# EAGLE design MEFI (EAGLE 9.6.1)
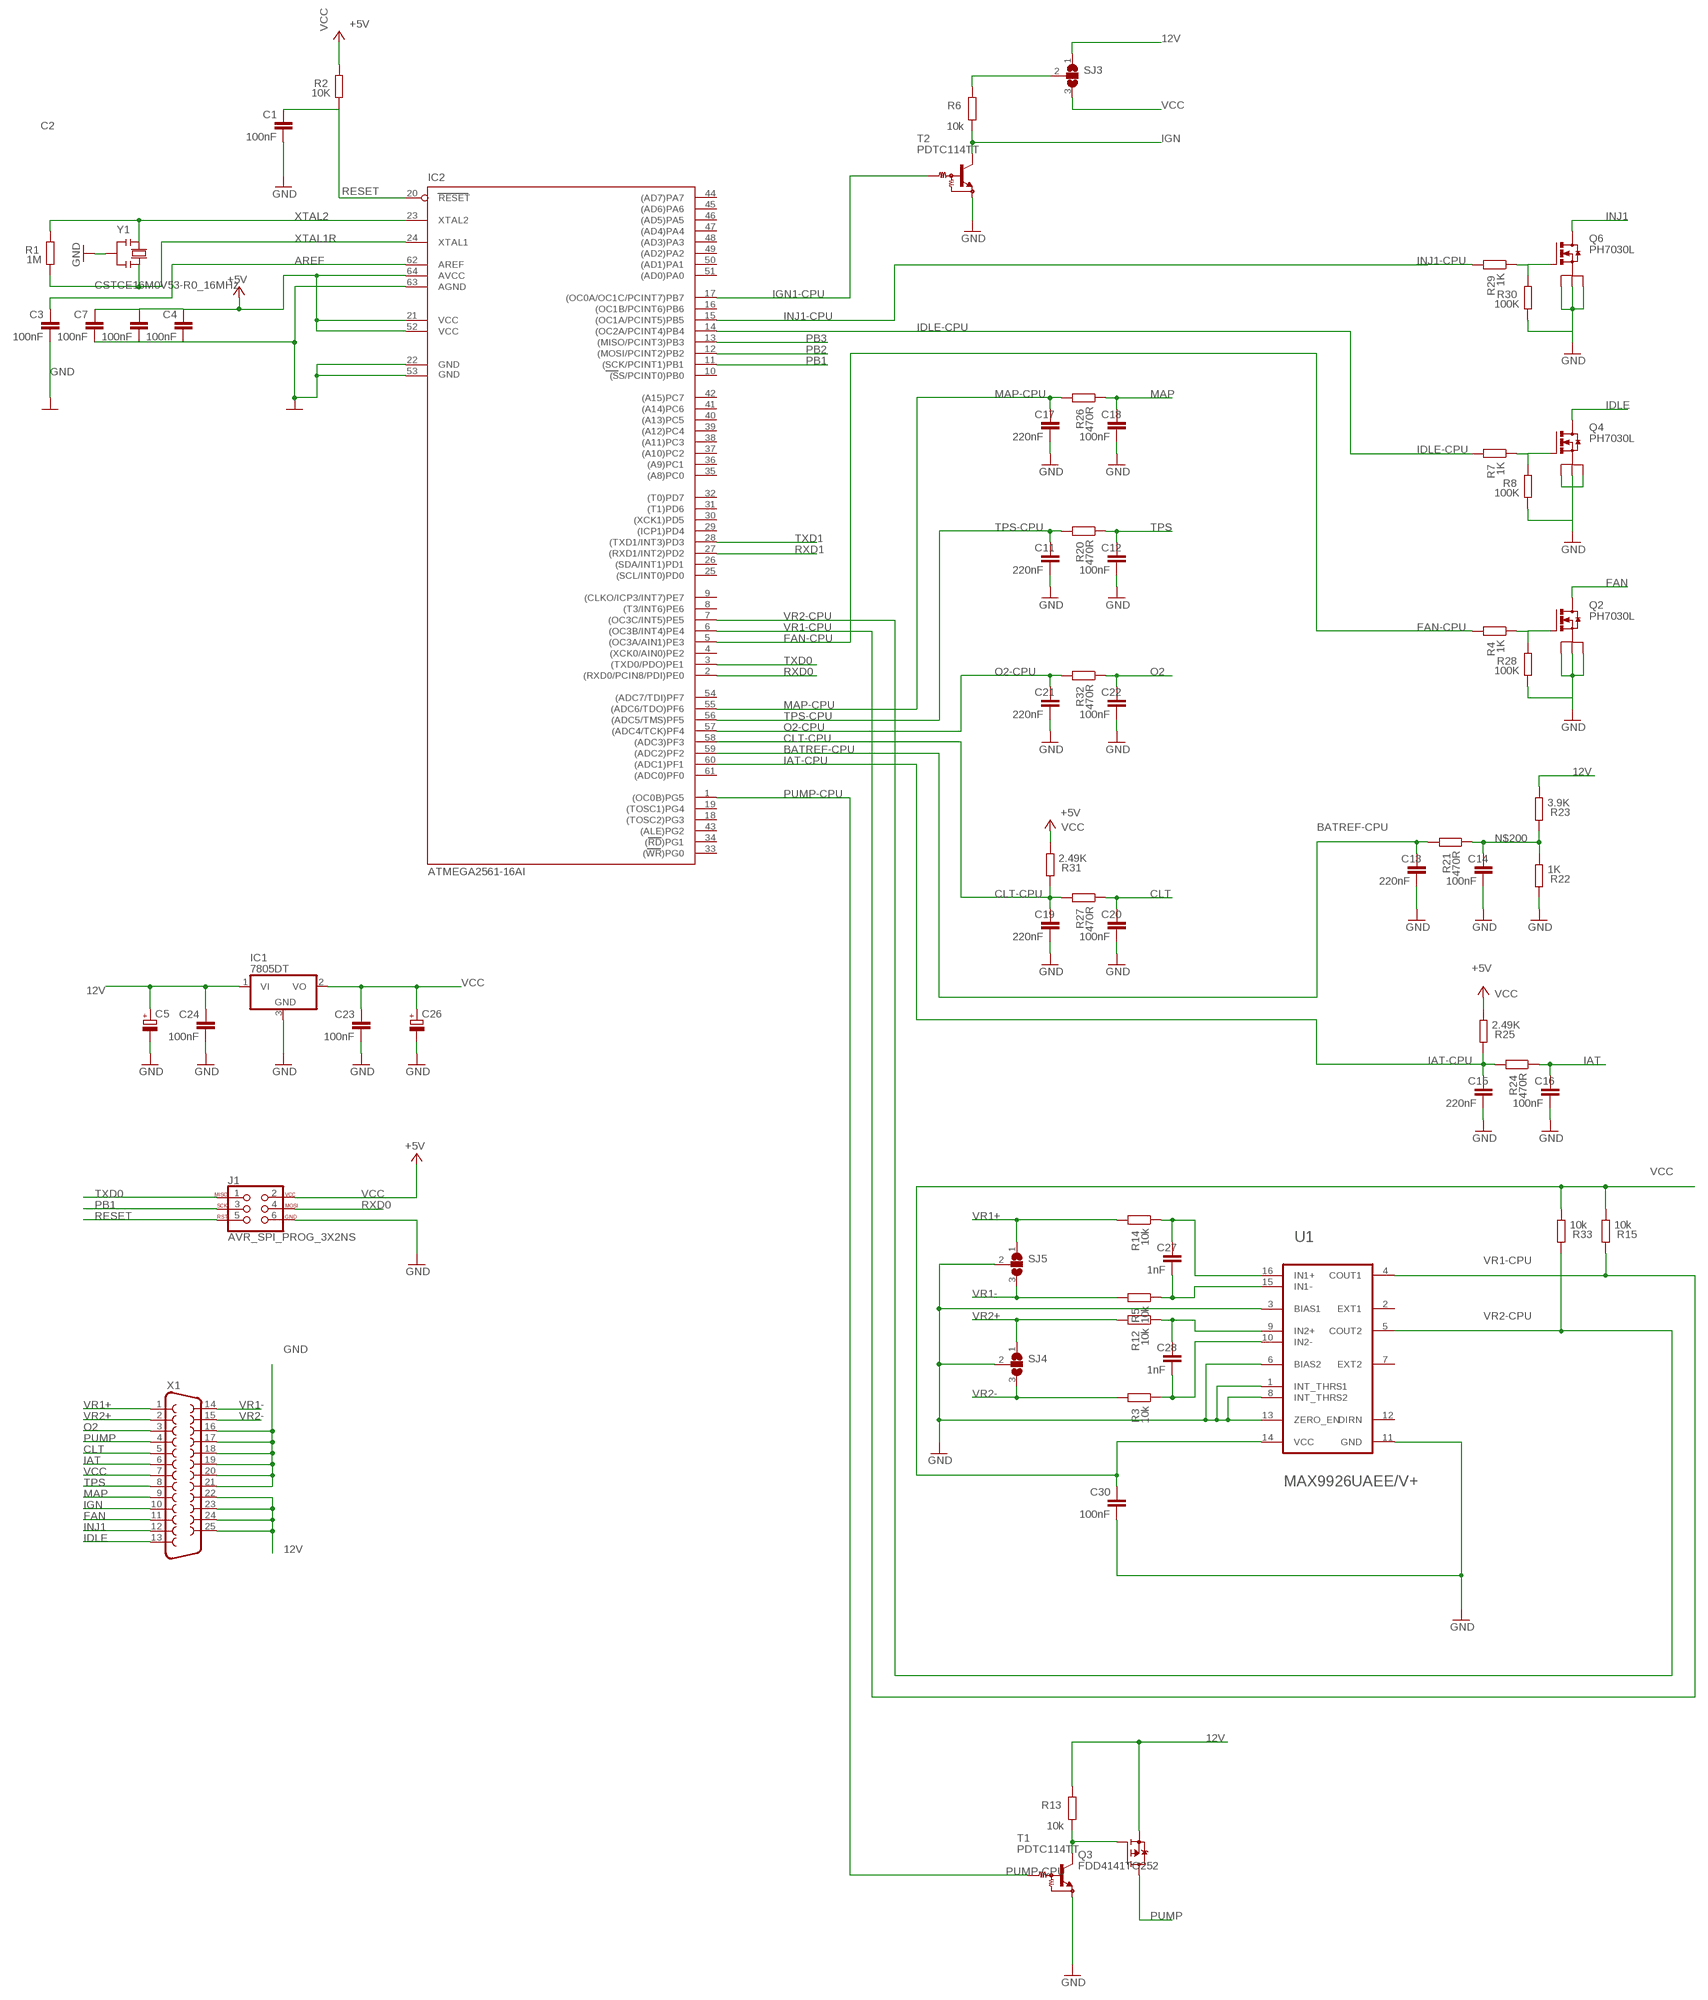
[diagram p0: schematic, sheet 1]

## Parts
C1  100nF  C-EUC0805  [C0805]
C2  100nF  C-EUC0805  [C0805]
C3  100nF  C-EUC0805  [C0805]
C4  100nF  C-EUC0805  [C0805]
C5  CPOL-EUTT2D7L  [TT2D7L]
C7  100nF  C-EUC0805  [C0805]
C11  220nF  C-EUC0805  [C0805]
C12  100nF  C-EUC0805  [C0805]
C13  220nF  C-EUC0805  [C0805]
C14  100nF  C-EUC0805  [C0805]
C15  220nF  C-EUC0805  [C0805]
C16  100nF  C-EUC0805  [C0805]
C17  220nF  C-EUC0805  [C0805]
C18  100nF  C-EUC0805  [C0805]
C19  220nF  C-EUC0805  [C0805]
C20  100nF  C-EUC0805  [C0805]
C21  220nF  C-EUC0805  [C0805]
C22  100nF  C-EUC0805  [C0805]
C23  100nF  C-EUC0805  [C0805]
C24  100nF  C-EUC0805  [C0805]
C26  CPOL-EUTT2D7L  [TT2D7L]
C27  1nF  C-EUC0805  [C0805]
C28  1nF  C-EUC0805  [C0805]
C30  100nF  C-EUC0805  [C0805]
IC1  7805DT  [TO252]
IC2  ATMEGA2561-16AI  [TQFP64]
J1  AVR_SPI_PROG_3X2NS  [2X3-NS]
Q2  PH7030L  [SOT669]
Q3  FDD4141TO252  [TO252]
Q4  PH7030L  [SOT669]
Q6  PH7030L  [SOT669]
R1  1M  R-EU_R0805  [R0805]
R2  10K  R-EU_R0805  [R0805]
R3  10k  R-EU_R0805  [R0805]
R4  1K  R-EU_R0805  [R0805]
R5  10k  R-EU_R0805  [R0805]
R6  10k  R-EU_R0805  [R0805]
R7  1K  R-EU_R0805  [R0805]
R8  100K  R-EU_R0805  [R0805]
R12  10k  R-EU_R0805  [R0805]
R13  10k  R-EU_R0805  [R0805]
R14  10k  R-EU_R0805  [R0805]
R15  10k  R-EU_R0805  [R0805]
R20  470R  R-EU_R0805  [R0805]
R21  470R  R-EU_R0805  [R0805]
R22  1K  R-EU_R0805  [R0805]
R23  3.9K  R-EU_R0805  [R0805]
R24  470R  R-EU_R0805  [R0805]
R25  2.49K  R-EU_R0805  [R0805]
R26  470R  R-EU_R0805  [R0805]
R27  470R  R-EU_R0805  [R0805]
R28  100K  R-EU_R0805  [R0805]
R29  1K  R-EU_R0805  [R0805]
R30  100K  R-EU_R0805  [R0805]
R31  2.49K  R-EU_R0805  [R0805]
R32  470R  R-EU_R0805  [R0805]
R33  10k  R-EU_R0805  [R0805]
SJ3  SJ2W  [SJ_2]
SJ4  SJ2W  [SJ_2]
SJ5  SJ2W  [SJ_2]
T1  PDTC114TT  MUN2214T1-NPN_DRIVER-SC59-BEC  [SC59-BEC]
T2  PDTC114TT  MUN2214T1-NPN_DRIVER-SC59-BEC  [SC59-BEC]
U1  MAXIM_MAX9926UAEE-V+MAXIM_MAX9926UAEE-V+_0_0  [MAXIM_MAX9926UAEE-V+_0]
X1  F25D  [F25D]
Y1  CSTCE16M0V53-R0_16MHz  RESONATORMU  [RESONATOR]

## Nets
12V: C5.+ C24.1 IC1.1(VI) Q3.2(S) R13.2 R23.1 SJ3.1 X1.22 X1.23 X1.24 X1.25
AREF: C3.1 IC2.62(AREF)
BATREF-CPU: C13.1 IC2.59((ADC2)PF2) R21.2
CLT: C20.1 R27.1 X1.5
CLT-CPU: C19.1 IC2.58((ADC3)PF3) R27.2 R31.2
FAN: Q2.MB(D) X1.11
FAN-CPU: IC2.5((OC3A/AIN1)PE3) R4.2
GND: C1.2 C2.2 C3.2 C4.2 C5.- C7.2 C11.2 C12.2 C13.2 C14.2 C15.2 C16.2 C17.2 C18.2 C19.2 C20.2 C21.2 C22.2 C23.2 C24.2 C26.- C30.2 IC1.3(GND) IC2.22(GND) IC2.53(GND1) IC2.63(AGND) J1.6 Q2.1(S) Q2.2(S) Q2.3(S) Q4.1(S) Q4.2(S) Q4.3(S) Q6.1(S) Q6.2(S) Q6.3(S) R8.1 R22.2 R28.1 R30.1 SJ4.2 SJ5.2 T1.E T2.E U1.1(INT_THRS1) U1.3(BIAS1) U1.6(BIAS2) U1.8(INT_THRS2) U1.11(GND) U1.13(ZERO_EN) X1.16 X1.17 X1.18 X1.19 X1.20 X1.21 Y1.2
IAT: C16.1 R24.1 X1.6
IAT-CPU: C15.1 IC2.60((ADC1)PF1) R24.2 R25.2
IDLE: Q4.MB(D) X1.13
IDLE-CPU: IC2.14((OC2A/PCINT4)PB4) R7.2
IGN: R6.1 T2.C X1.10
IGN1-CPU: IC2.17((OC0A/OC1C/PCINT7)PB7) T2.B
INJ1: Q6.MB(D) X1.12
INJ1-CPU: IC2.15((OC1A/PCINT5)PB5) R29.2
MAP: C18.1 R26.1 X1.9
MAP-CPU: C17.1 IC2.55((ADC6/TDO)PF6) R26.2
N$7: Q2.4(G) R4.1 R28.2
N$13: Q6.4(G) R29.1 R30.2
N$33: C28.2 R3.1 U1.10(IN2-)
N$34: C27.2 R5.1 U1.15(IN1-)
N$36: R6.2 SJ3.2
N$48: Q3.1(G) R13.1 T1.C
N$49: C27.1 R14.1 U1.16(IN1+)
N$52: C28.1 R12.1 U1.9(IN2+)
N$91: Q4.4(G) R7.1 R8.2
N$200: C14.1 R21.1 R22.1 R23.2
O2: C22.1 R32.1 X1.3
O2-CPU: C21.1 IC2.57((ADC4/TCK)PF4) R32.2
PB1: IC2.11((SCK/PCINT1)PB1) J1.3
PB2: IC2.12((MOSI/PCINT2)PB2)
PB3: IC2.13((MISO/PCINT3)PB3)
PUMP: Q3.3(D) X1.4
PUMP-CPU: IC2.1((OC0B)PG5) T1.B
RESET: C1.1 IC2.20(RESET) J1.5 R2.1
RXD0: IC2.2((RXD0/PCIN8/PDI)PE0) J1.4
RXD1: IC2.27((RXD1/INT2)PD2)
TPS: C12.1 R20.1 X1.8
TPS-CPU: C11.1 IC2.56((ADC5/TMS)PF5) R20.2
TXD0: IC2.3((TXD0/PDO)PE1) J1.1
TXD1: IC2.28((TXD1/INT3)PD3)
VCC: C2.1 C4.1 C7.1 C23.1 C26.+ C30.1 IC1.2(VO) IC2.21(VCC) IC2.52(VCC1) IC2.64(AVCC) J1.2 R2.2 R15.1 R25.1 R31.1 R33.1 SJ3.3 U1.14(VCC) X1.7 ; supply symbol labelled +5V
VR1+: R14.2 SJ5.1 X1.1
VR1-: R5.2 SJ5.3 X1.14
VR1-CPU: IC2.6((OC3B/INT4)PE4) R15.2 U1.4(COUT1)
VR2+: R12.2 SJ4.1 X1.2
VR2-: R3.2 SJ4.3 X1.15
VR2-CPU: IC2.7((OC3C/INT5)PE5) R33.2 U1.5(COUT2)
XTAL1R: IC2.24(XTAL1) R1.1 Y1.3
XTAL2: IC2.23(XTAL2) R1.2 Y1.1
Unconnected: IC2.4((XCK0/AIN0)PE2) IC2.8((T3/INT6)PE6) IC2.9((CLKO/ICP3/INT7)PE7) IC2.10((SS/PCINT0)PB0) IC2.16((OC1B/PCINT6)PB6) IC2.18((TOSC2)PG3) IC2.19((TOSC1)PG4) IC2.25((SCL/INT0)PD0) IC2.26((SDA/INT1)PD1) IC2.29((ICP1)PD4) IC2.30((XCK1)PD5) IC2.31((T1)PD6) IC2.32((T0)PD7) IC2.33((WR)PG0) IC2.34((RD)PG1) IC2.35((A8)PC0) IC2.36((A9)PC1) IC2.37((A10)PC2) IC2.38((A11)PC3) IC2.39((A12)PC4) IC2.40((A13)PC5) IC2.41((A14)PC6) IC2.42((A15)PC7) IC2.43((ALE)PG2) IC2.44((AD7)PA7) IC2.45((AD6)PA6) IC2.46((AD5)PA5) IC2.47((AD4)PA4) IC2.48((AD3)PA3) IC2.49((AD2)PA2) IC2.50((AD1)PA1) IC2.51((AD0)PA0) IC2.54((ADC7/TDI)PF7) IC2.61((ADC0)PF0) U1.2(EXT1) U1.7(EXT2) U1.12(DIRN)

## Library data of the parts
C1-C4 C7 C11-C16 C18-C24 C27 C28 C30 = SmartPrj:C-EU: CAPACITOR, European symbol
C5 C26 = rcl:CPOL-EU: POLARIZED CAPACITOR, European symbol; SPICEPREFIX: C
C17 = SmartPrj:C-EU: CAPACITOR, European symbol; SPICEPREFIX: C
IC1 = linear:78*: Positive VOLTAGE REGULATOR Source: http://cache.national.com/ds/LM/LM78L05.pdf http://www.fairchildsemi.com/ds/LM/LM7805.pdf
IC2 = atmel-2005:ATMEGA2561*: MICROCONTROLLER 256 Kbytes FLASH 4 Kbytes EEPROM 8 Kbytes SRAM 54 General Purpose I/O pins 6-channels 16-bit PWM 2 x Serial USARTs 8-channels 10-bit A/D
J1 = SparkFun-Connectors:AVR_SPI_PROG_3X2: AVR ISP 6 Pin This is the reduced ISP connector for AVR programming. Common on Arduino. This footprint will take up less PCB space and can be used with a 10-pin to 6-pin adapter such as SKU: BOB-08508 **Special note about "TEST_POINT" package. The stop mask is on the top side, so if you want your programming test points to be on the bottom of your board, make sure to place this package on the bottom side of the board. This also ensure that the orientation to program from the bottom side will be correct. SparkFun Products: SparkFun ISP Pogo Adapter <https://www.sparkfun.com/products/11591> - NS Tiny AVR Programmer <https://www.sparkfun.com/products/11801> -PTH; SPICEPREFIX: X
Q2 Q4 Q6 = transistor-power:PH7030L: N-channel TrenchMOS (TM) logic level FET Source: http://www.nxp.com/acrobat_download/datasheets/PH7030L_4.pdf
Q3 = transistor-fet:FDD4141: P-Channel PowerTrench® MOSFET Source: FDD4141.pdf
R1-R8 R12-R15 R20-R33 = SmartPrj:R-EU_: RESISTOR, European symbol
SJ3-SJ5 = jumper:SJ2W: SMD solder JUMPER
T1 T2 = transistor:*-NPN_DRIVER-: NPN Bias Resistor Transistor
U1 = V+:MAXIM_MAX9926UAEE-V+: MAX9926-E16+1; CHANNELS: 2; CIIVA_IDS: 2416713; CODE__JEDEC: MO137; COMPONENT_LINK_1_DESCRIPTION: Manufacturer URL; COMPONENT_LINK_1_URL: http://www.maximintegrated.com/; COMPONENT_LINK_3_DESCRIPTION: Package Specification; COMPONENT_LINK_3_URL: http://pdfserv.maximintegrated.com/package_dwgs/21-0055.PDF; DATASHEET: http://datasheets.maximintegrated.com/en/ds/MAX9924-MAX9927.pdf; DATASHEET_VERSION: Rev. 4; FOOTPRINT_VARIANT_NAME_0: Level C; FOOTPRINT_VARIANT_NAME_1: Level B; FOOTPRINT_VARIANT_NAME_2: Level A; IMPORTED: yes; IMPORTED_FROM: vault; IMPORT_TS: 1521846696; INDUSTRY_QUALIFIED: Automotive - General; LOW_PWR_SHUTDN: No; MF: Maxim; MOUNTING_TECHNOLOGY: Surface Mount; MPN: MAX9926UAEE/V+; PACKAGE: E16+1; PACKAGE_DESCRIPTION: 16-Pin Quarter Small-Outline Package (E16+1), Body 4.90 x 3.89 mm, Pitch 0.635 mm; PACKAGE_VERSION: Rev. K, 04/2012; PREFIX: U; RELEASE_DATE: 1372767992; VAULT_GUID: 84C1A6AA-892B-4A72-8B24-F0CE8AD503BB; VAULT_REVISION: 8F29DC4F-A407-426E-B283-448D3F7714D4
X1 = con-subd:F25: SUB-D; OC_FARNELL: unknown; OC_NEWARK: unknown
Y1 = SmartPrj:RESONATOR

## Net classes
0 default: width 0.15 mm, drill 0.3 mm, clearance 0.205 mm

## Board
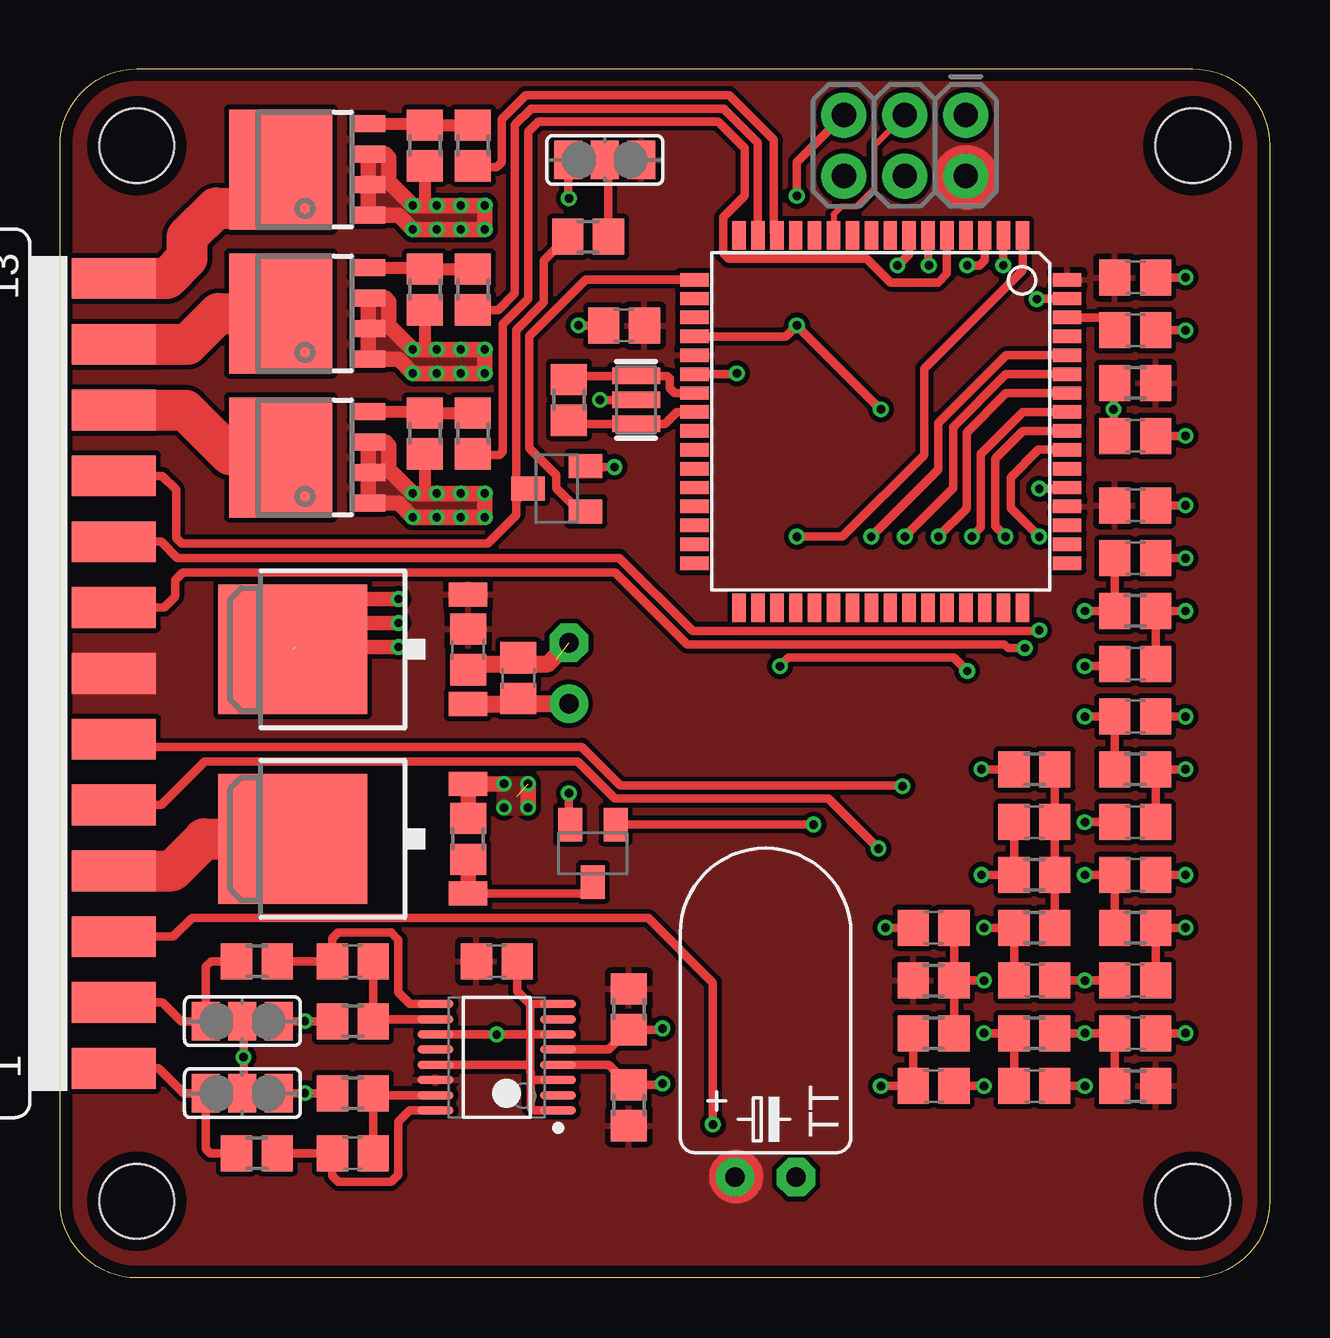
[diagram p1: board, top side]
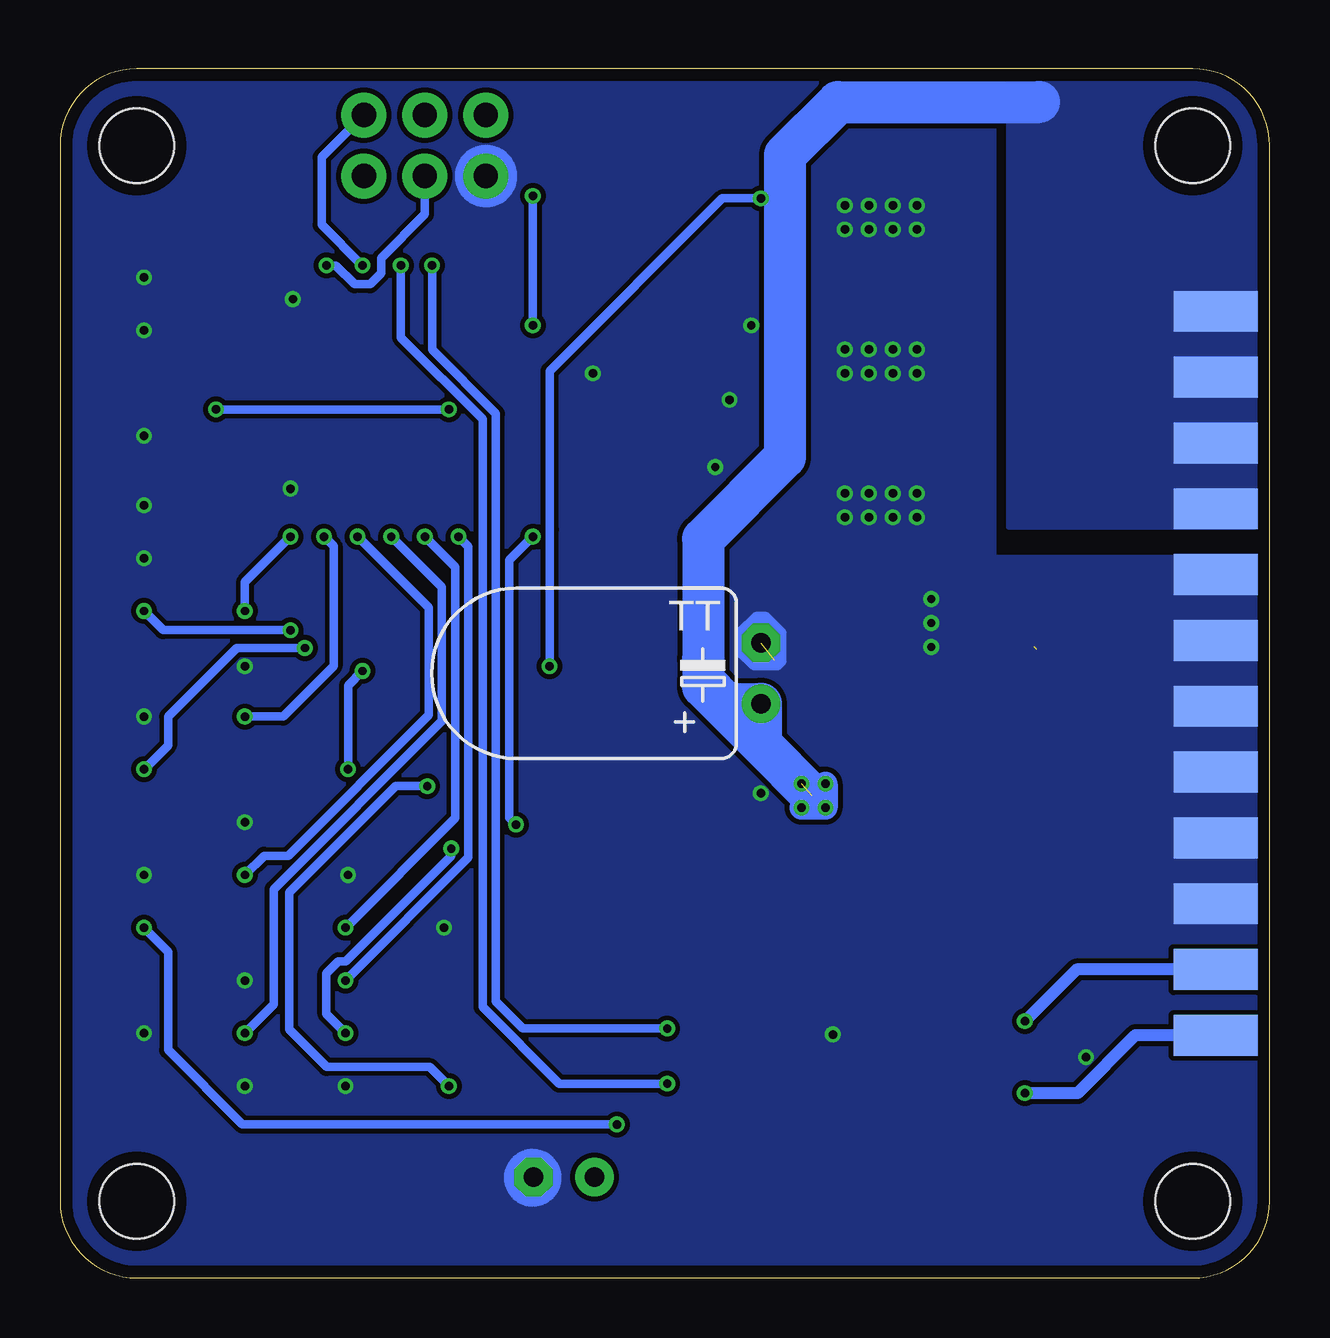
[diagram p2: board, bottom side, seen from below]

Size 50.4 x 50.4 mm. Coordinates in mm from the lower left corner, seen from the top.
Outline: 3.2,0 arc-90 0,3.2 0,47.2 arc-90 3.2,50.4 47.2,50.4 arc-90 50.4,47.2 50.4,3.2 arc-90 47.2,0 3.2,0
Copper layers (1*16): Top 0.035mm / dielectric 1.6mm / Bottom 0.035mm
Design rules "Elecrow_2-layer_PCB_eagle_rule": minimum track width 6mil, minimum drill 12mil, track to track 6mil, track to pad 6mil, pad to pad 6mil, via to via 8mil, smd to smd 0mil, copper to edge 20mil, drill to drill 10mil, minimum pad ring 6mil, minimum via ring 6mil, stop-mask expansion 0mil, vias tented up to drill 100mil, thermal gap 10mil
Holes 3.1 mm at 3.2,47.2 47.2,47.2 47.2,3.2 3.2,3.2

### Footprints (pad centres in the part's own frame; a part is rotated, then mirrored left to right if it is on the bottom)
C0805 = smd 1.3 x 1.5: 1 -0.85,0; 2 0.85,0
TT2D7L = drill 0.813 pad 1.6: + -1.27,0 | drill 0.813 pad 1.6 octagon: - 1.27,0
TO252 = smd 1 x 1.6: 1 -2.28,-4.8; 2 2.28,-4.8 | smd 5.4 x 6.2: 3 0,2.5
TQFP64 = smd 1.194 x 0.559: 1 -7.76,5.905; 2 -7.76,5.118; 3 -7.76,4.331; 4 -7.76,3.543; 5 -7.76,2.756; 6 -7.76,1.968; 7 -7.76,1.181; 8 -7.76,0.394; 9 -7.76,-0.394; 10 -7.76,-1.181; 11 -7.76,-1.968; 12 -7.76,-2.756; 13 -7.76,-3.543; 14 -7.76,-4.331; 15 -7.76,-5.118; 16 -7.76,-5.905; 33 7.76,-5.905; 34 7.76,-5.118; 35 7.76,-4.331; 36 7.76,-3.543; 37 7.76,-2.756; 38 7.76,-1.968; 39 7.76,-1.181; 40 7.76,-0.394; 41 7.76,0.394; 42 7.76,1.181; 43 7.76,1.968; 44 7.76,2.756; 45 7.76,3.543; 46 7.76,4.331; 47 7.76,5.118; 48 7.76,5.905 | smd 0.559 x 1.194: 17 -5.905,-7.76; 18 -5.118,-7.76; 19 -4.331,-7.76; 20 -3.543,-7.76; 21 -2.756,-7.76; 22 -1.968,-7.76; 23 -1.181,-7.76; 24 -0.394,-7.76; 25 0.394,-7.76; 26 1.181,-7.76; 27 1.968,-7.76; 28 2.756,-7.76; 29 3.543,-7.76; 30 4.331,-7.76; 31 5.118,-7.76; 32 5.905,-7.76; 49 5.905,7.76; 50 5.118,7.76; 51 4.331,7.76; 52 3.543,7.76; 53 2.756,7.76; 54 1.968,7.76; 55 1.181,7.76; 56 0.394,7.76; 57 -0.394,7.76; 58 -1.181,7.76; 59 -1.968,7.76; 60 -2.756,7.76; 61 -3.543,7.76; 62 -4.331,7.76; 63 -5.118,7.76; 64 -5.905,7.76
2X3-NS = drill 1.016 pad 1.88: 1 -2.54,-1.27; 2 -2.54,1.27; 3 0,-1.27; 4 0,1.27; 5 2.54,-1.27; 6 2.54,1.27
SOT669 = smd 0.7 x 1.4: 1 -1.905,-2.65; 2 -0.635,-2.65; 3 0.635,-2.65; 4 1.905,-2.65 | smd 5 x 4.3: MB 0,1
R0805 = smd 1.3 x 1.5: 1 -0.85,0; 2 0.85,0
SJ_2 = smd 1.168 x 1.6: 1 -1.524,0; 2 0,0; 3 1.524,0
SC59-BEC = smd 1 x 1.4: B -0.95,-1.2; C 0,1.2; E 0.95,-1.2
MAXIM_MAX9926UAEE-V+_0 = smd 1.5 x 0.35: 1 -2.55,2.222; 2 -2.55,1.587; 3 -2.55,0.952; 4 -2.55,0.317; 5 -2.55,-0.318; 6 -2.55,-0.952; 7 -2.55,-1.587; 8 -2.55,-2.222; 9 2.55,-2.222; 10 2.55,-1.587; 11 2.55,-0.952; 12 2.55,-0.318; 13 2.55,0.317; 14 2.55,0.952; 15 2.55,1.587; 16 2.55,2.222
F25D = smd 1.7 x 3.5: 1 -16.459,-6.045; 2 -13.716,-6.045; 3 -10.973,-6.045; 4 -8.23,-6.045; 5 -5.486,-6.045; 6 -2.743,-6.045; 7 0,-6.045; 8 2.743,-6.045; 9 5.486,-6.045; 10 8.23,-6.045; 11 10.973,-6.045; 12 13.716,-6.045; 13 16.459,-6.045 | smd 1.7 x 3.5 bottom: 14 -15.088,-6.045; 15 -12.344,-6.045; 16 -9.601,-6.045; 17 -6.858,-6.045; 18 -4.115,-6.045; 19 -1.372,-6.045; 20 1.372,-6.045; 21 4.115,-6.045; 22 6.858,-6.045; 23 9.601,-6.045; 24 12.344,-6.045; 25 15.088,-6.045
RESONATOR = smd 0.7 x 2: 1 -1,0; 2 0,0; 3 1,0

### Placement (x,y rotation side)
C1  44.8,35.1 0 top
C2  44.8,32.2 0 top
C3  44.8,39.5 0 top
C4  23.5,39.7 180 top
C5  21.2,25.2 90 bottom
C7  44.8,41.7 0 top
C11  44.8,23.4 0 top
C12  44.8,19 180 top
C13  40.6,12.4 0 top
C14  40.6,19 180 top
C15  36.4,14.6 180 top
C16  36.4,8 0 top
C17  44.8,30 0 top
C18  44.8,25.6 180 top
C19  44.8,10.2 0 top
C20  40.6,8 0 top
C21  44.8,16.8 0 top
C22  44.8,12.4 180 top
C23  17,26.2 270 top
C24  19.1,25 90 top
C26  29.4,4.2 0 top
C27  12.2,5.2 0 top
C28  12.2,13.2 0 top
C30  18.2,13.2 0 top
IC1  12.2,26.2 90 top
IC2  34.2,35.7 270 top
J1  35.2,47.2 180 top
Q2  10.2,34.2 90 top
Q3  12.2,18.3 90 top
Q4  10.2,46.2 90 top
Q6  10.2,40.2 90 top
R1  21.2,36.6 90 top
R2  44.8,37.3 0 top
R3  12.2,10.7 180 top
R4  17.2,35.2 270 top
R5  12.2,7.7 180 top
R6  22,43.4 0 top
R7  17.2,47.2 270 top
R8  15.2,47.2 90 top
R12  8.2,13.2 180 top
R13  17,18.3 90 top
R14  8.2,5.2 180 top
R15  23.7,7.2 90 top
R20  44.8,21.2 180 top
R21  40.6,14.6 180 top
R22  40.6,16.8 180 top
R23  40.6,21.2 0 top
R24  36.4,10.2 0 top
R25  36.4,12.4 0 top
R26  44.8,27.8 180 top
R27  40.6,10.2 0 top
R28  15.2,35.2 90 top
R29  17.2,41.2 270 top
R30  15.2,41.2 90 top
R31  44.8,8 180 top
R32  44.8,14.6 180 top
R33  23.7,11.2 270 top
SJ3  22.7,46.6 0 top
SJ4  7.6,10.7 0 top
SJ5  7.6,7.7 0 top
T1  22.2,17.7 180 top
T2  20.7,32.9 90 top
U1  18.2,9.2 180 top
X1  -3.8,25.2 90 top
Y1  24,36.6 270 top

### Tracks (layer width: path | path; a pad name or v marks a point on that pad's centre or on a via)
12V  (via drill 0.35)  (1 unrouted)
  Top 0.35: v21.2,45 21.18,45.02 SJ3.1 | R23.1 v38.4,21.2 | v37.8,25.3 37.25,25.85 30.35,25.85 v30,25.5
  Top 0.5: 18.87,23.92 C24.1
  Top 0.655: R13.2 Q3.2 17.02,20.6 v18.5,20.6 | v19.5,19.6 v19.5,20.6
  Top 0.7: IC1.1 18.87,23.92 | C5.+ 19.32,23.93 C24.1
  Bottom 0.35: v38.4,21.2 38.4,24.7 v37.8,25.3 | v30,25.5 30,25.7 29.99,25.71 29.99,31.19 30,31.2 30,37.8 22.8,45 v21.2,45 20.19,45
  Bottom 1: v18.5,20.6 v18.5,19.6 v19.5,19.6
  Bottom 1.75: 9.6,49.02 17.98,49.02 20.19,46.81 20.19,45 20.19,34.21 23.6,30.8 23.6,25.8 23.6,24.9 | 23.6,24.9 22.63,23.93 C5.+ 21.2,22.25 | 19.05,20.1 21.2,22.25 | 21.2,22.25 23.6,24.65 23.6,24.9
  pour Bottom: 10.9,50.2 10.9,31.3 0.2,31.3 0.2,47.2 arc-90 3.2,50.2
  pour Top: 18.5,20.6 19.5,20.6 19.5,19.6 18.5,19.6
  pour Bottom (no thermals): 0.6,41.5 4.35,41.5 4.35,31.3 0.6,31.3
AREF
  Top 0.35: IC2.62 43.42,40.03 C3.1
BATREF-CPU  (via drill 0.35)
  Top 0.35: IC2.59 39.42,37.67 37.22,35.47 37.22,32.92 v35.2,30.9 | C13.1 R21.2 v38.5,14.6
  Bottom 0.35: v38.5,14.6 33.94,19.16 33.94,29.63 v35.2,30.9
CLT  (via drill 0.35)
  Top 0.35: X1.5 4.21,19.71 6.04,21.54 21.56,21.54 23.12,19.98 32.02,19.98 v34.1,17.9 | C20.1 R27.1 v38.5,10.2
  Bottom 0.35: v38.5,10.2 39.3,11 39.3,12.7 38.8,13.2 38.5,13.2 34.1,17.6 v34.1,17.9
CLT-CPU  (via drill 0.35)
  Top 0.35: IC2.58 39.41,36.88 37.78,35.25 37.78,32.08 v36.6,30.9 | R31.2 C19.1 v42.7,10.2 R27.2
  Bottom 0.35: v42.7,10.2 41.5,11.4 41.5,16.2 34.49,23.21 34.49,28.79 v36.6,30.9
FAN
  Top 1.7: Q2.MB 9.3,34.3 7.1,34.3 5.23,36.17 X1.11
FAN-CPU
  Top 0.35: IC2.5 36.96,41.86 36.59,41.49 34.61,41.49 33.62,42.48 27.86,42.48 27.63,42.71 27.63,44.21 28.53,45.11 28.53,47.09 27.43,48.19 19.93,48.19 19.51,47.77 19.51,40.83 18.45,39.76 18.45,34.45 18.3,34.3 17.25,34.3 R4.2
GND  (via drill 0.35)  (2 unrouted)
  Top 0.35: v21.2,20.2 21.2,18.9 T1.E | Y1.2 v22.5,36.6 | v23.1,33.8 21.95,33.8 T2.E | v28.2,37.7 28.17,37.67 IC2.22 | v40.7,40.8 40.72,40.82 IC2.63 | C4.2 v21.6,39.7 | IC2.53 41.92,32.9 v40.8,32.9 | v46.9,32.2 C2.2 | C18.2 43.85,25.5 v42.7,25.5 | v46.9,23.4 C11.2 | v42.7,19 C12.2 | v46.9,16.8 C21.2 | C22.2 v42.7,12.4 C13.2 | v42.7,8 C20.2 | v46.9,10.2 C19.2 | C14.2 R22.2 v38.4,16.8 | v34.4,14.6 C15.2 | v38.5,8 C16.2 | 12.9,26.3 9.8,26.3 | v46.9,41.7 C7.2 | v46.9,35.1 C1.2 | v46.9,30 C17.2 | v46.9,39.5 C3.2 | U1.1 19.73,6.98 19.61,7.1 19.61,8.3 | 19.61,8.3 19.61,8.58 19.6,8.58 19.6,8.88 | 19.65,11.35 19.6,11.3 19.6,10.2 | 19.65,11.35 19.72,11.42 U1.8 | 19.6,8.88 19.6,10.2 | U1.6 19.65,10.15 | 19.65,10.15 19.6,10.2 | U1.3 19.66,8.25 19.61,8.3 | U1.13 19.6,8.88 | U1.11 v18.2,10.15 19.65,10.15 | C30.2 19.05,11.95 19.65,11.35 | SJ4.2 7.65,10.65 v7.65,9.2 7.65,7.75 SJ5.2
  Top 0.5: R28.1 15.2,32.7 | R8.1 15.2,44.7 | R30.1 15.2,38.7 | C23.2 17.25,25.6 | 18.85,25.6 C24.2 19.35,25.6
  Top 0.6: v14.1,28.3 11.9,28.3 | v14.1,27.3 12,27.3 | v14.1,26.3 12.9,26.3
  Top 0.655: Q6.1 14.1,38.3 v14.7,37.7 v17.7,37.7 v17.7,38.7 15.2,38.7 v14.7,38.7 13.7,39.7 13.7,40.7 13.56,40.84 Q6.3 Q6.1 | Q4.1 14.1,44.3 v14.7,43.7 v17.7,43.7 v17.7,44.7 15.2,44.7 v14.7,44.7 13.7,45.7 13.7,46.7 13.56,46.84 Q4.3 Q4.1 | Q2.1 14.1,32.3 v14.7,31.7 v17.7,31.7 v17.7,32.7 15.2,32.7 v14.7,32.7 13.7,33.7 13.7,34.7 13.56,34.84 Q2.3 Q2.1
  Top 0.7: 17.25,25.6 18.85,25.6 | 19.35,25.6 20.33,25.6 C5.-
  Bottom 0.35: 20.45,25.8 21.7,25.8 22,26.1 22,26.75 21.4,27.35 20.95,27.35 20.4,26.8 20.4,26 20.65,25.75 | 20.3,25.7 20.3,26.9 21,27.6 21.4,27.6 22.1,26.9 22.1,26.1 21.5,25.5 20.5,25.5 20.3,25.7
  Bottom 0.5: 31.6,45.95 arc-357 31.6,45.9 | 29.75,4.2 arc-357 29.75,4.15
  other vias: 15.7,38.7 16.7,38.7 15.7,44.7 16.7,44.7 15.7,32.7 16.7,32.7 15.7,43.7 16.7,43.7 15.7,31.7 16.7,31.7 15.7,37.7 16.7,37.7
  pour Bottom: 0.2,30.05 0.2,3.2 arc90 3.2,0.2 47.2,0.2 arc90 50.2,3.2 50.2,47.2 arc90 47.2,50.2 11.5,50.2 11.5,30.05
  pour Top (no thermals): 12.8,34.5 12.8,32.3 14.1,32.3 14.7,31.7 17.6,31.7 17.6,32.7 14.8,32.7 14.7,32.6 13.6,33.7 13.6,34.5
  pour Top (no thermals): 12.8,46.5 12.8,44.3 14.1,44.3 14.7,43.7 17.6,43.7 17.6,44.7 14.8,44.7 14.7,44.6 13.6,45.7 13.6,46.5
  pour Top (no thermals): 12.8,40.5 12.8,38.3 14.1,38.3 14.7,37.7 17.6,37.7 17.6,38.7 14.8,38.7 14.7,38.6 13.6,39.7 13.6,40.5
  pour Bottom (no thermals): 4.3,30.05 0.6,30.05 0.6,14.15 4.3,14.15
IAT  (via drill 0.35)
  Top 0.35: R24.1 C16.1 v34.2,8 | X1.6 2.56,22.14 21.75,22.14 23.35,20.54 35.07,20.54 v35.1,20.5
  Bottom 0.35: v34.2,8 34.99,8.79 39.29,8.79 40.86,10.35 40.86,16.06 36.42,20.5 v35.1,20.5
IAT-CPU  (via drill 0.35)
  Top 0.35: IC2.60 39.42,38.46 36.59,35.63 36.59,33.69 v33.8,30.9 | v38.5,12.4 R25.2 | C15.1 R25.2 | R25.2 R24.2
  Bottom 0.35: v38.5,12.4 33.38,17.52 33.38,30.48 v33.8,30.9
IDLE
  Top 1.7: X1.13 4.46,41.66 5.3,42.5 5.3,43.4 6.5,44.6 7.9,44.6 9.2,45.9 Q4.MB
IDLE-CPU
  Top 0.35: IC2.14 29.74,43.59 29.74,47.44 27.88,49.3 19.4,49.3 18.4,48.3 18.4,46.5 18.2,46.3 17.25,46.3 R7.2
IGN
  Top 0.35: X1.10 4.27,33.43 4.84,32.86 4.84,30.84 5.07,30.62 17.82,30.62 19,31.8 19,32.4 T2.C 19.3,32.9 19,33.2 19,39.52 20.15,40.67 20.15,42.4 R6.1
IGN1-CPU
  Top 0.35: IC2.17 21.91,41.61 19.55,39.25 19.55,34.58 20.68,33.46 20.68,32.92 21.65,31.95 T2.B
INJ1
  Top 1.7: X1.12 5.32,38.92 6.6,40.2 Q6.MB
INJ1-CPU
  Top 0.35: R29.2 18.25,40.35 18.95,41.05 18.95,48.07 19.63,48.75 27.65,48.75 29.08,47.32 IC2.15
MAP  (via drill 0.35)
  Top 0.35: C18.1 R26.1 v46.9,27.8 | X1.9 4.21,30.69 4.89,30.01 23.31,30.01 26.36,26.96 40.54,26.96 40.58,27 v40.8,27
  Bottom 0.35: v40.8,27 46.1,27 v46.9,27.8
MAP-CPU  (via drill 0.35)
  Top 0.35: IC2.55 40.76,34.52 39.61,33.37 39.61,32.09 v40.8,30.9 | C17.1 R26.2 v42.7,27.8
  Bottom 0.35: v40.8,30.9 42.7,29 v42.7,27.8
N$7
  Top 0.5: Q2.4 15.14,36.11 R28.2 R4.1
N$13
  Top 0.5: Q6.4 15.14,42.11 R30.2 R29.1
N$33
  Top 0.35: U1.10 13.14,10.79 R3.1 C28.2
N$34
  Top 0.35: U1.15 13.14,7.61 | 13.14,7.61 R5.1 | C27.2 13.05,7.53 13.14,7.61
N$36
  Top 0.35: R6.2 22.85,46.45 SJ3.2
N$48
  Top 0.35: Q3.1 22.2,16.02 T1.C
  Top 0.655: Q3.1 R13.1
N$49
  Top 0.35: R14.1 C27.1 11.35,4.25 11.6,4 12.9,4 13.8,4 14.1,4.3 14.1,6.5 14.58,6.98 U1.16
N$52
  Top 0.35: R12.1 C28.1 11.35,14.15 11.6,14.4 13.8,14.4 14.1,14.1 14.1,11.9 14.58,11.42 U1.9
N$91
  Top 0.5: Q4.4 15.14,48.11 R8.2 R7.1
N$200
  Top 0.35: R21.1 R22.1 C14.1 R23.2
O2  (via drill 0.35)
  Top 0.35: X1.3 4.73,14.23 5.5,15 24.5,15 27.2,12.3 v27.2,6.4 | C22.1 R32.1 v46.9,14.6
  Bottom 0.35: v27.2,6.4 42.8,6.4 45.9,9.5 45.9,13.6 v46.9,14.6
O2-CPU  (via drill 0.35)
  Top 0.35: IC2.57 40.12,36.09 38.37,34.34 38.37,31.27 v38,30.9 | v42.7,16.8 C21.1 R32.2
  Bottom 0.35: v42.7,16.8 41.9,17.6 40.9,17.6 35.05,23.45 35.05,27.95 v38,30.9
PB1
  Top 0.25: J1.3 33.93,47.2 33.93,45.4 33.19,44.66 32.56,44.66 32.23,44.33 IC2.11
PUMP
  Top 1.7: X1.4 4.67,16.97 6,18.3 Q3.3
PUMP-CPU  (via drill 0.35)
  Top 0.35: 39.59,41.49 | IC2.1 40.11,42.01 39.59,41.49 | 39.59,41.49 36,37.9 36,34.3 32.6,30.9 v30.7,30.9 | v31.4,18.9 T1.B
  Bottom 0.35: v30.7,30.9 31.68,29.92 31.68,19.18 v31.4,18.9
RESET  (via drill 0.35)
  Top 0.35: J1.5 30.7,46.51 v30.7,45.1 | IC2.20 30.24,39.24 v30.7,39.7 v34.2,36.2 | C1.1 43.9,35.15 v43.9,36.2 43.9,37.25 R2.1
  Bottom 0.35: v30.7,45.1 v30.7,39.7 | v34.2,36.2 v43.9,36.2
RXD0  (via drill 0.35)
  Top 0.35: v39.3,42.2 39.3,43.44 IC2.2
  Bottom 0.35: J1.4 35.2,44.33 37.02,42.51 37.02,41.88 37.48,41.42 38.12,41.42 38.91,42.2 v39.3,42.2
TPS  (via drill 0.35)
  Top 0.35: X1.8 4.34,27.94 4.8,28.4 4.8,29.1 5.11,29.41 23.13,29.41 26.13,26.41 39.35,26.41 39.5,26.26 v40.2,26.26 | v46.9,21.2 R20.1 C12.1
  Bottom 0.35: v40.2,26.26 43.04,26.26 45.9,23.4 45.9,22.2 v46.9,21.2
TPS-CPU  (via drill 0.35)
  Top 0.35: IC2.56 40.12,35.31 38.96,34.15 38.96,31.34 v39.4,30.9 | v42.7,23.4 C11.1 R20.2
  Bottom 0.35: v39.4,30.9 39,30.5 39,25.5 41.1,23.4 v42.7,23.4
TXD0  (via drill 0.35)
  Top 0.35: IC2.3 38.53,42.43 38.3,42.2 v37.8,42.2
  Bottom 0.35: J1.1 39.5,46.71 39.5,43.9 v37.8,42.2
VCC
  Top 0.5: 36.65,45.9 arc-357 36.65,45.85 | 27.3,4.25 arc-357 27.3,4.2
  pour Top: 47.2,0.2 3.2,0.2 arc-90 0.2,3.2 0.2,47.2 arc-90 3.2,50.2 47.2,50.2 arc-90 50.2,47.2 50.2,3.2 arc-90
  pour Top (no thermals): 0.68,26.6 0.68,23.9 4.2,23.9 4.5,24.2 4.5,26.25 4.15,26.6
VR1+
  Top 0.35: X1.1 4.11,8.74 5.15,7.7 SJ5.1 6.08,5.37 6.25,5.2 R14.2
VR1-  (via drill 0.35)
  Top 0.35: R5.2 v10.2,7.7 SJ5.3
  Bottom 0.5: X1.14 5.59,10.11 8,7.7 v10.2,7.7
VR1-CPU  (via drill 0.35)
  Top 0.35: U1.4 22.87,8.88 R15.2 25.05,8.05 v25.1,8.1 | IC2.6 36.17,42.23 v36.2,42.2
  Bottom 0.35: v36.2,42.2 36.2,39.2 32.79,35.79 32.79,11.29 29.6,8.1 v25.1,8.1
VR2+
  Top 0.35: X1.2 4.27,11.48 5.05,10.7 SJ4.1 6.08,12.98 6.3,13.2 R12.2
VR2-  (via drill 0.35)
  Top 0.35: R3.2 v10.2,10.7 SJ4.3
  Bottom 0.5: X1.15 8.04,12.86 v10.2,10.7
VR2-CPU  (via drill 0.35)
  Top 0.35: U1.5 22.87,9.52 R33.2 25.05,10.35 v25.1,10.4 | IC2.7 35.38,42.68 v34.9,42.2
  Bottom 0.35: v34.9,42.2 34.9,38.69 32.24,36.02 32.24,11.52 31.11,10.4 v25.1,10.4
XTAL1R
  Top 0.35: R1.1 21.35,35.6 Y1.3 25.2,35.6 25.69,36.09 IC2.24
XTAL2
  Top 0.35: R1.2 21.35,37.6 Y1.1 25.3,37.6 25.4,37.5 25.4,37.1 25.62,36.88 IC2.23

### Text on the board
tStop: Powered by Speeduino
bStop: Designed by Klempnertommy